# EAGLE design USBIRToy-shield (EAGLE 5.07)
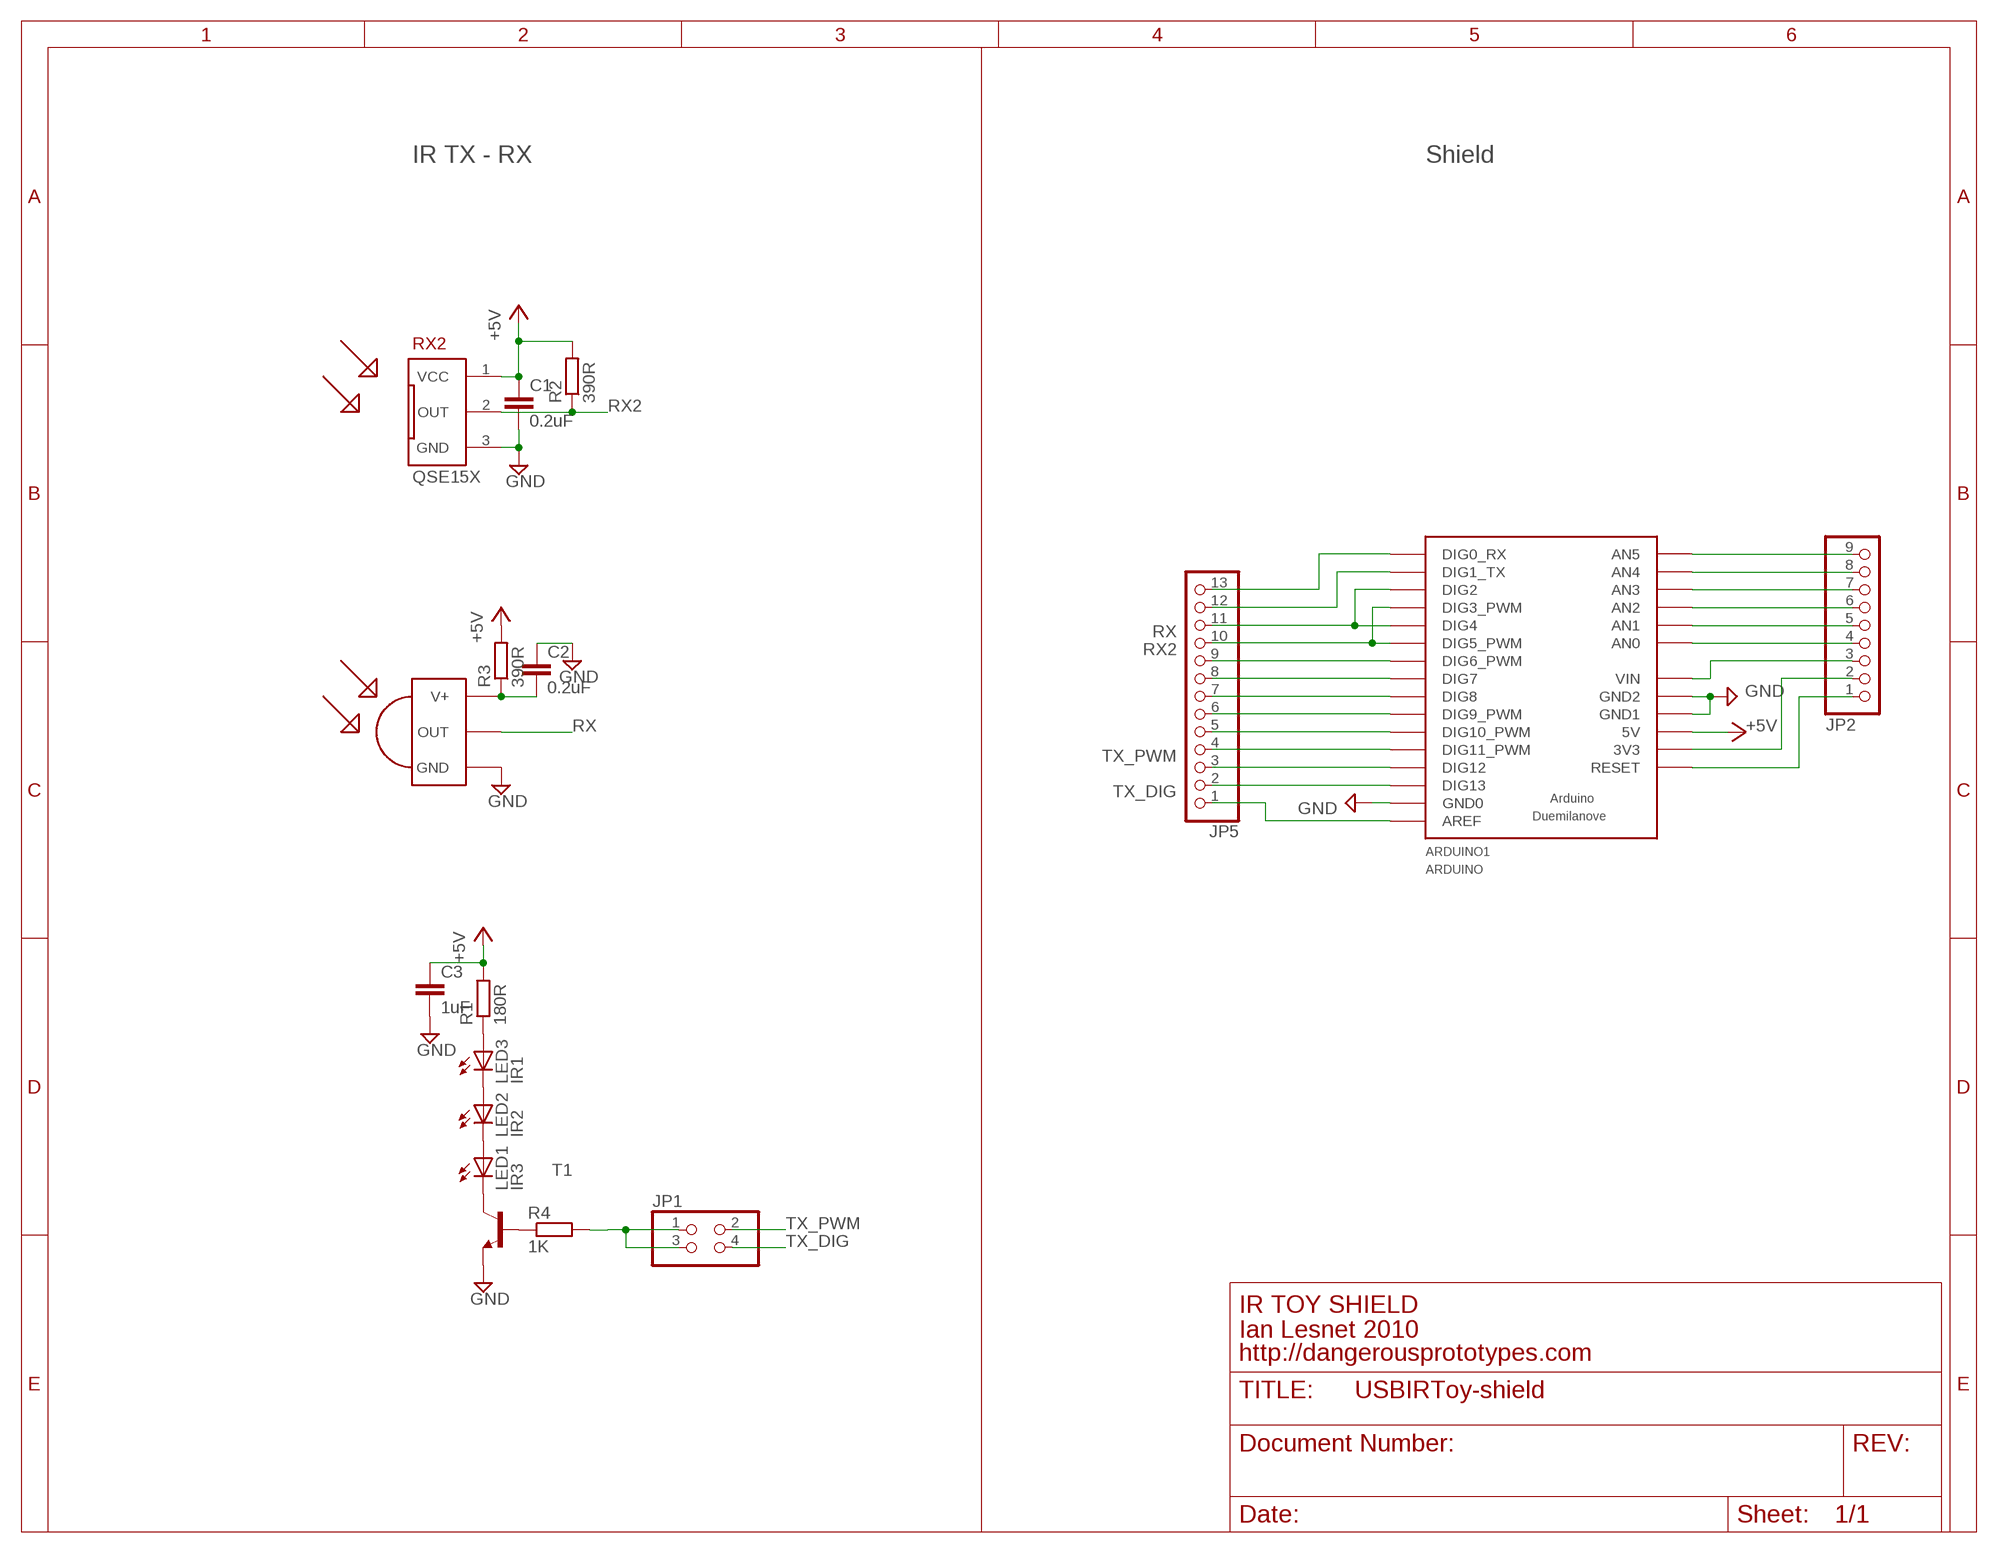
[diagram p0: schematic, sheet 1]

## Parts
ARDUINO1  ARDUINO  [ARDUINO]
C1  0.2uF  C-EUC0603  [C0603]
C2  0.2uF  C-EUC0603  [C0603]
C3  1uF  C-EUC0603  [C0603]
JP1  PINHD-2X02_2.54  [2X02]
JP2  PINHD-1X09_2.54-S  [1X09-S]
JP5  PINHD-1X13_2.54-S  [1X13-S]
LED1  IR3  LED5MM  [LED5MM]
LED2  IR2  LED5MM  [LED5MM]
LED3  IR1  LED5MM  [LED5MM]
R1  180R  R-EU_R0805  [R0805]
R2  390R  R-EU_R0603  [R0603]
R3  390R  R-EU_R0603  [R0603]
R4  1K  R-EU_R0603  [R0603]
RX1  TSOP4838  [TSOP18XX]
RX2  QSE15X  [QSE15X]
T1  NPNSOT23BEC  [SOT23-BEC]

## Nets
+5V: ARDUINO1.5V C1.1 C3.1 R1.2 R2.2 R3.2 RX2.1(VCC)
GND: ARDUINO1.GND0 ARDUINO1.GND1 ARDUINO1.GND2 C1.2 C2.1 C3.2 RX1.GND RX2.3(GND) T1.E
N$1: LED1.K(C) T1.C
N$2: LED1.A LED2.K(C)
N$3: LED2.A LED3.K(C)
N$4: LED3.A R1.1
N$5: R4.1 T1.B
N$7: C2.2 R3.1 RX1.VCC(V+)
N$209: ARDUINO1.D_0(DIG0_RX) JP5.13
N$210: ARDUINO1.D_1(DIG1_TX) JP5.12
N$211: ARDUINO1.D_6(DIG6_PWM) JP5.9
N$212: ARDUINO1.D_7(DIG7) JP5.8
N$213: ARDUINO1.D_8(DIG8) JP5.7
N$214: ARDUINO1.D_9(DIG9_PWM) JP5.6
N$215: ARDUINO1.D_10(DIG10_PWM) JP5.5
N$216: ARDUINO1.D_12(DIG12) JP5.3
N$217: ARDUINO1.AREF JP5.1
N$218: ARDUINO1.A_5(AN5) JP2.9
N$219: ARDUINO1.A_4(AN4) JP2.8
N$220: ARDUINO1.A_3(AN3) JP2.7
N$221: ARDUINO1.A_2(AN2) JP2.6
N$222: ARDUINO1.A_1(AN1) JP2.5
N$223: ARDUINO1.A_0(AN0) JP2.4
N$224: ARDUINO1.VIN JP2.3
N$225: ARDUINO1.3V3 JP2.2
N$226: ARDUINO1.RESET JP2.1
RX: ARDUINO1.D_2(DIG2) ARDUINO1.D_4(DIG4) JP5.11 RX1.OUT
RX2: ARDUINO1.D_3(DIG3_PWM) ARDUINO1.D_5(DIG5_PWM) JP5.10 R2.1 RX2.2(OUT)
TX: JP1.1 JP1.3 R4.2
TX_DIG: ARDUINO1.D_13(DIG13) JP1.4 JP5.2
TX_PWM: ARDUINO1.D_11(DIG11_PWM) JP1.2 JP5.4

## Notes on the sheet
- IR TX - RX | Shield
- IR TOY SHIELD
- Ian Lesnet 2010
- http://dangerousprototypes.com

## Library data of the parts
ARDUINO1 = dp_devices:ARDUINO
C1-C3 = rcl:C-EU: CAPACITOR, European symbol
JP1 = pinhead-2:PINHD-2X02: PIN HEADER
JP2 = pinhead-2:PINHD-1X09: PIN HEADER
JP5 = pinhead-2:PINHD-1X13: PIN HEADER
LED1-LED3 = led:LED: LED OSRAM: - CHIPLED LG R971, LG N971, LY N971, LG Q971, LY Q971, LO R971, LY R971 LH N974, LH R974 LS Q976, LO Q976, LY Q976 LO Q996 - Hyper CHIPLED LW Q18S LB Q993, LB Q99A, LB R99A - SideLED LS A670, LO A670, LY A670, LG A670, LP A670 LB A673, LV A673, LT A673, LW A673 LH A674 LY A675 LS A676, LA A676, LO A676, LY A676, LW A676 LS A679, LY A679, LG A679 - Hyper Micro SIDELED® LS Y876, LA Y876, LO Y876, LY Y876 LT Y87S - SmartLED LW L88C, LW L88S LB L89C, LB L89S, LG L890 LS L89K, LO L89K, LY L89K LS L896, LA L896, LO L896, LY L896 - TOPLED LS T670, LO T670, LY T670, LG T670, LP T670 LSG T670, LSP T670, LSY T670, LOP T670, LYG T670 LG T671, LOG T671, LSG T671 LB T673, LV T673, LT T673, LW T673 LH T674 LS T676, LA T676, LO T676, LY T676, LB T676, LH T676, LSB T676, LW T676 LB T67C, LV T67C, LT T67C, LS T67K, LO T67K, LY T67K, LW E67C LS E67B, LA E67B, LO E67B, LY E67B, LB E67C, LV E67C, LT E67C LW T67C LS T679, LY T679, LG T679 LS T770, LO T770, LY T770, LG T770, LP T770 LB T773, LV T773, LT T773, LW T773 LH T774 LS E675, LA E675, LY E675, LS T675 LS T776, LA T776, LO T776, LY T776, LB T776 LHGB T686 LT T68C, LB T68C - Hyper Mini TOPLED® LB M676 - Mini TOPLED Santana® LG M470 LS M47K, LO M47K, LY M47K Source: http://www.osram.convergy.de LUXEON: - LUMILED® LXK2-PW12-R00, LXK2-PW12-S00, LXK2-PW14-U00, LXK2-PW14-V00 LXK2-PM12-R00, LXK2-PM12-S00, LXK2-PM14-U00 LXK2-PE12-Q00, LXK2-PE12-R00, LXK2-PE12-S00, LXK2-PE14-T00, LXK2-PE14-U00 LXK2-PB12-K00, LXK2-PB12-L00, LXK2-PB12-M00, LXK2-PB14-N00, LXK2-PB14-P00, LXK2-PB14-Q00 LXK2-PR12-L00, LXK2-PR12-M00, LXK2-PR14-Q00, LXK2-PR14-R00 LXK2-PD12-Q00, LXK2-PD12-R00, LXK2-PD12-S00 LXK2-PH12-R00, LXK2-PH12-S00 LXK2-PL12-P00, LXK2-PL12-Q00, LXK2-PL12-R00 Source: www.luxeon.com KINGBRIGHT: KA-3528ASYC Source: www.kingbright.com
R1-R4 = rcl:R-EU_: RESISTOR, European symbol
RX1 = tsop:TSOP4838: IR Receiver and Demodulator
RX2 = dp_devices:QSE15X
T1 = dp_devices:NPN: Most commonly used is SOT23-BEC

## Board
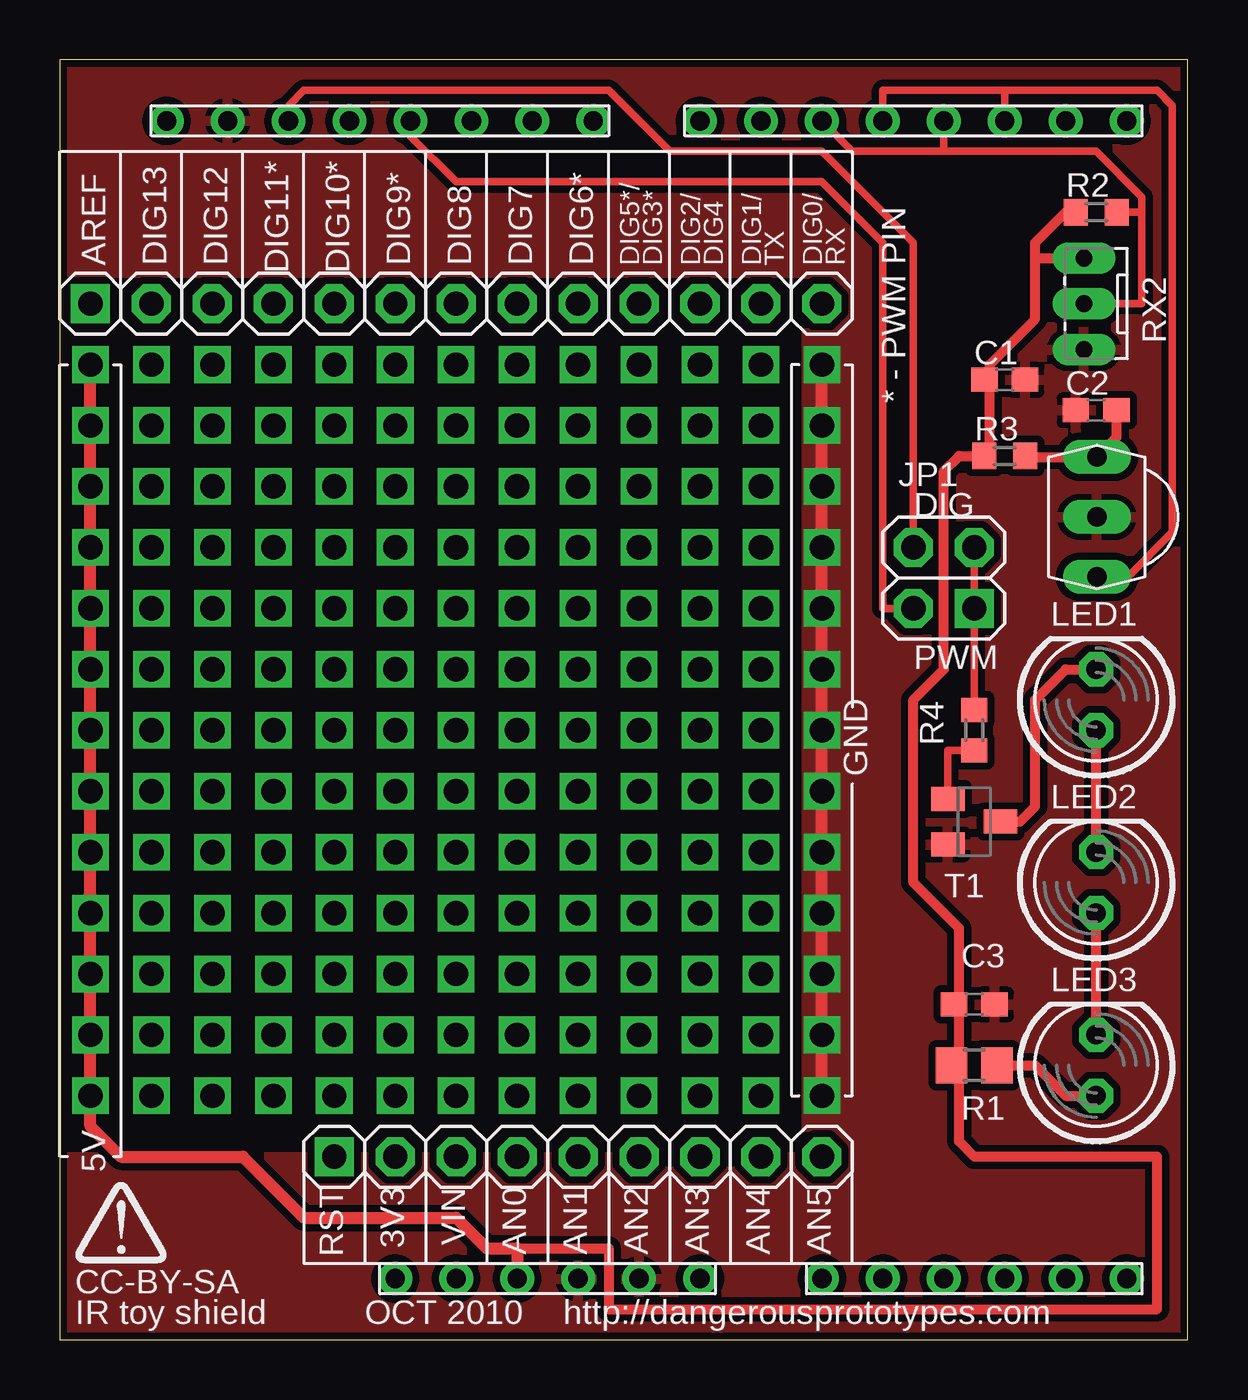
[diagram p1: board, top side]
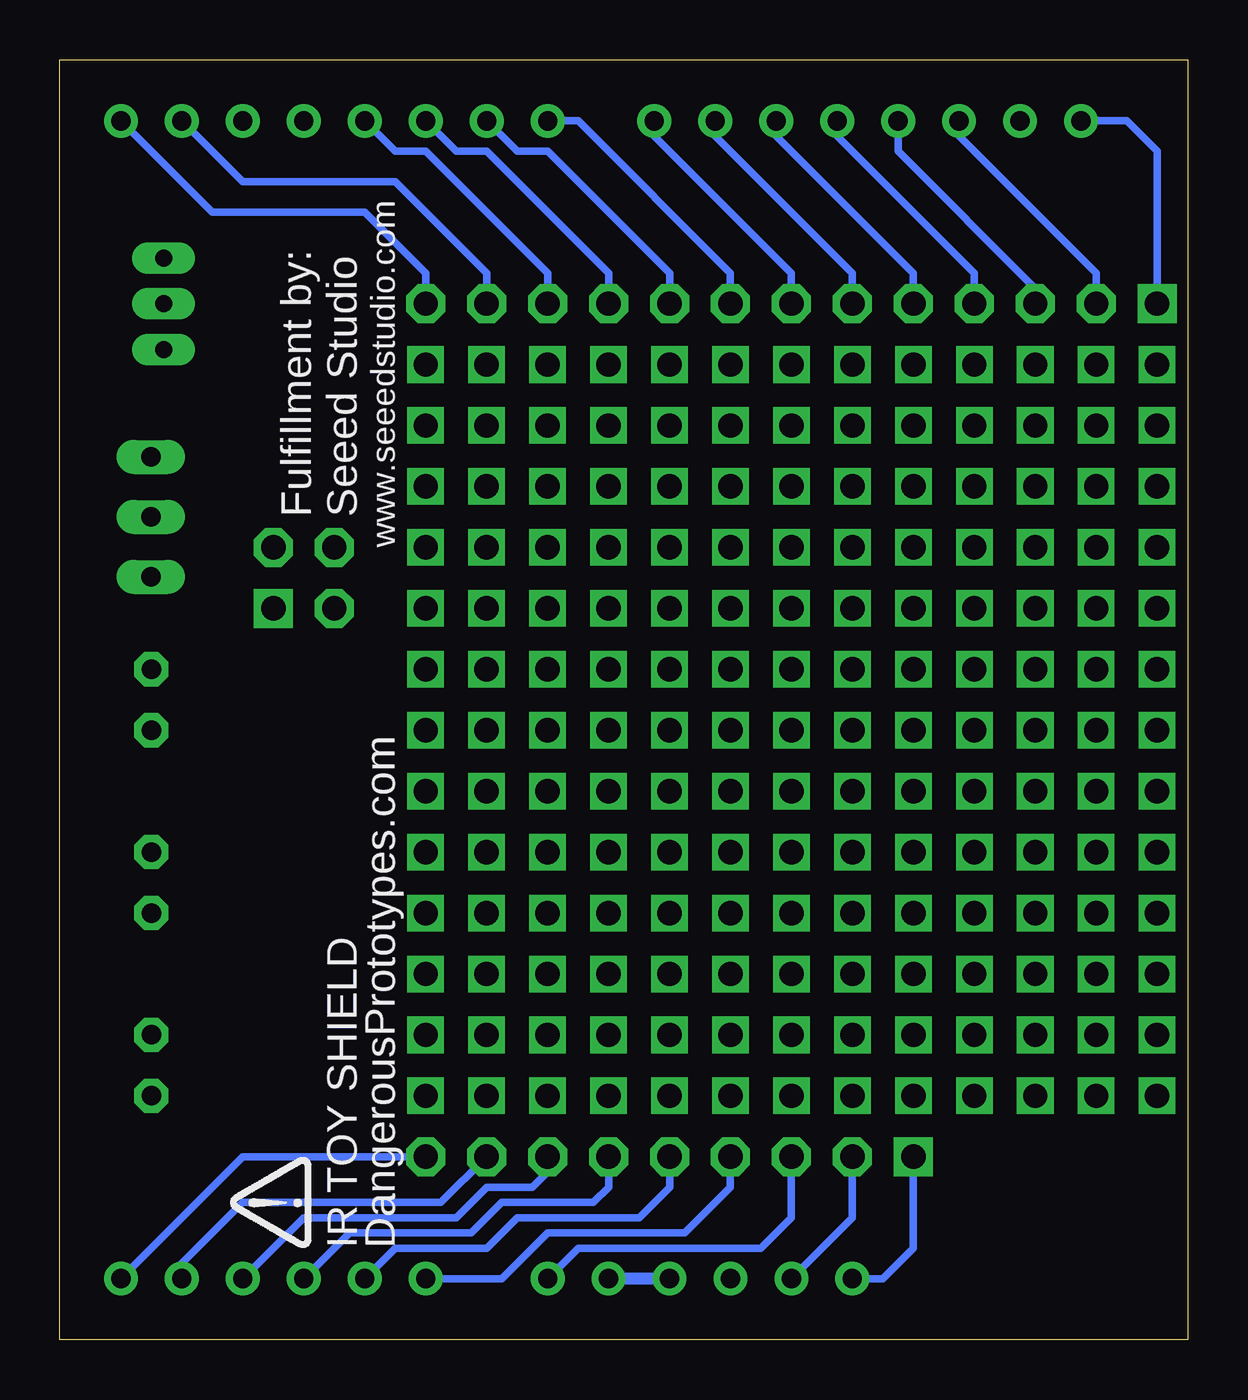
[diagram p2: board, bottom side, seen from below]

Size 46.99 x 53.34 mm. Coordinates in mm from the lower left corner, seen from the top.
Outline: 0,0 46.99,0 46.99,53.34 0,53.34 0,0
Copper layers (1*16): Top 0.035mm / dielectric 1.5mm / Bottom 0.035mm
Design rules "SparkFun": minimum track width 8mil, minimum drill 20mil, track to track 8mil, track to pad 8mil, pad to pad 8mil, via to via 8mil, smd to smd 8mil, copper to edge 10mil, drill to drill 8mil, minimum pad ring 12mil, minimum via ring 10mil, stop-mask expansion 4mil, vias tented up to drill 25mil, thermal gap 10mil

### Footprints (pad centres in the part's own frame; a part is rotated, then mirrored left to right if it is on the bottom)
ARDUINO = drill 0.8 round: 3V3 25.4,-12.7; 5V 25.4,-10.16; A_0 25.4,2.54; A_1 25.4,5.08; A_2 25.4,7.62; A_3 25.4,10.16; A_4 25.4,12.7; A_5 25.4,15.24; AREF -22.86,-24.765; D_0 -22.86,15.24; D_1 -22.86,12.7; D_2 -22.86,10.16; D_3 -22.86,7.62; D_4 -22.86,5.08; D_5 -22.86,2.54; D_6 -22.86,0; D_7 -22.86,-2.54; D_8 -22.86,-6.985; D_9 -22.86,-9.525; D_10 -22.86,-12.065; D_11 -22.86,-14.605; D_12 -22.86,-17.145; D_13 -22.86,-19.685; GND0 -22.86,-22.225; GND1 25.4,-7.62; GND2 25.4,-5.08; RESET 25.4,-15.24; VIN 25.4,-2.54
C0603 = smd 1.1 x 1: 1 -0.85,0; 2 0.85,0
2X02 = drill 1.016 square: 1 -1.27,-1.27 | drill 1.016 octagon: 2 -1.27,1.27; 3 1.27,-1.27; 4 1.27,1.27
1X09-S = drill 1.016 square: 1 -10.16,0 | drill 1.016 octagon: 2 -7.62,0; 3 -5.08,0; 4 -2.54,0; 5 0,0; 6 2.54,0; 7 5.08,0; 8 7.62,0; 9 10.16,0
1X13-S = drill 1.016 square: 1 -15.24,0 | drill 1.016 octagon: 2 -12.7,0; 3 -10.16,0; 4 -7.62,0; 5 -5.08,0; 6 -2.54,0; 7 0,0; 8 2.54,0; 9 5.08,0; 10 7.62,0; 11 10.16,0; 12 12.7,0; 13 15.24,0
LED5MM = drill 0.813 octagon: A -1.27,0; K 1.27,0
R0805 = smd 1.3 x 1.5: 1 -0.95,0; 2 0.95,0
R0603 = smd 1 x 1.1: 1 -0.85,0; 2 0.85,0
TSOP18XX = drill 0.813 long: GND -0.001,-0.027; OUT -2.501,-0.027; VCC 2.499,-0.027
QSE15X = drill 0.7 long: 1 -1.9,-0.51; 2 0,-0.51; 3 1.91,-0.51
SOT23-BEC = smd 1 x 1.4: B -0.95,-1.1; C 0,1.1; E 0.95,-1.1

### Placement (x,y rotation side)
ARDUINO1  29.21,27.94 270 top
C1  39.37,40.01 0 top
C2  43.18,38.73 0 top
C3  38.1,13.97 0 top
JP1  36.83,31.75 90 top
JP2  21.59,7.62 0 top
JP5  16.51,43.18 0 top
LED1  43.18,26.67 90 top
LED2  43.18,19.05 90 top
LED3  43.18,11.43 90 top
R1  38.1,11.43 180 top
R2  43.18,46.99 180 top
R3  39.37,36.83 180 top
R4  38.1,25.4 90 top
RX1  43.18,34.29 90 top
RX2  43.18,43.18 270 top
T1  38.1,21.59 270 top
U$1  [DP-LOGO_TOP]  0.64,3.17 0 top
U$2  [DP-LOGO-BOTTOM]  36.51,7.62 270 top

### Tracks (layer width: path | path; a pad name or v marks a point on that pad's centre or on a via)
+5V  (via drill 1.02)
  Top 0.406: 37.47,14.19 37.47,17.14 35.56,19.05 35.56,26.67 36.83,27.94 36.83,36.2 37.47,36.83 R3.2 | 37.47,11.74 37.47,13.97 | 37.47,11.43 37.47,8.26 38.1,7.62 45.72,7.62 45.72,1.27 22.86,1.27 22.86,3.81 19.05,3.81 | R2.2 41.91,46.99 40.64,45.72 40.64,45.09 | 40.64,45.09 40.64,42.55 38.73,40.64 38.73,40.22 C1.1 38.73,39.79 38.73,37.05 | RX2.1 40.65,45.08 40.64,45.09
  Top 0.508: 37.47,14.19 C3.1 37.47,13.97 | 37.47,11.74 R1.2 36.83,11.11 37.15,11.11 37.47,11.43 | R3.2 38.73,37.05 | v1.27,40.64 v1.27,38.1 v1.27,35.56 v1.27,33.02 v1.27,30.48 v1.27,27.94 v1.27,25.4 v1.27,22.86 v1.27,20.32 v1.27,17.78 v1.27,15.24 v1.27,12.7 v1.27,10.16 1.27,8.89 2.54,7.62 7.62,7.62 10.16,5.08 16.51,5.08 17.78,3.81 19.05,3.81 ARDUINO1.5V
GND  (via drill 1.02)
  Top 0.508: v31.75,40.64 v31.75,38.1 v31.75,35.56 v31.75,33.02 v31.75,30.48 v31.75,27.94 v31.75,25.4 v31.75,22.86 v31.75,20.32 v31.75,17.78 v31.75,15.24 v31.75,12.7 v31.75,10.16
  Bottom 0.508: ARDUINO1.GND1 ARDUINO1.GND2
  pour Top (isolate 0.305): 0,53.34 46.99,53.34 46.99,0 0,0 0,7.62 31.11,7.62 31.11,44.45 0,44.45
N$1
  Top 0.406: LED1.K 41.91,27.94 40.64,26.67 40.64,22.23 40.01,21.59 T1.C
N$2
  Top 0.406: LED2.K LED1.A
N$3
  Top 0.406: LED3.K LED2.A
N$4
  Top 0.406: R1.1 40.64,11.43 41.91,10.16 LED3.A
N$5
  Top 0.305: R4.1 37,24.55 T1.B
N$6  (via drill 1.02)
  other vias: 16.51,38.1
N$7
  Top 0.406: C2.2 44.03,37.61 RX1.VCC 40.26,36.79
  Top 0.508: R3.1 40.26,36.79
N$8  (via drill 1.02)
  other vias: 13.97,38.1
N$9  (via drill 1.02)
  other vias: 11.43,38.1
N$10  (via drill 1.02)
  other vias: 8.89,38.1
N$11  (via drill 1.02)
  other vias: 6.35,38.1
N$12  (via drill 1.02)
  other vias: 3.81,38.1
N$14  (via drill 1.02)
  other vias: 19.05,38.1
N$15  (via drill 1.02)
  other vias: 21.59,38.1
N$16  (via drill 1.02)
  other vias: 24.13,38.1
N$17  (via drill 1.02)
  other vias: 26.67,38.1
N$18  (via drill 1.02)
  other vias: 29.21,38.1
N$20  (via drill 1.02)
  other vias: 16.51,35.56
N$21  (via drill 1.02)
  other vias: 13.97,35.56
N$22  (via drill 1.02)
  other vias: 11.43,35.56
N$23  (via drill 1.02)
  other vias: 8.89,35.56
N$24  (via drill 1.02)
  other vias: 6.35,35.56
N$25  (via drill 1.02)
  other vias: 3.81,35.56
N$27  (via drill 1.02)
  other vias: 19.05,35.56
N$28  (via drill 1.02)
  other vias: 21.59,35.56
N$29  (via drill 1.02)
  other vias: 24.13,35.56
N$30  (via drill 1.02)
  other vias: 26.67,35.56
N$31  (via drill 1.02)
  other vias: 29.21,35.56
N$33  (via drill 1.02)
  other vias: 16.51,33.02
N$34  (via drill 1.02)
  other vias: 13.97,33.02
N$35  (via drill 1.02)
  other vias: 11.43,33.02
N$36  (via drill 1.02)
  other vias: 8.89,33.02
N$37  (via drill 1.02)
  other vias: 6.35,33.02
N$38  (via drill 1.02)
  other vias: 3.81,33.02
N$40  (via drill 1.02)
  other vias: 19.05,33.02
N$41  (via drill 1.02)
  other vias: 21.59,33.02
N$42  (via drill 1.02)
  other vias: 24.13,33.02
N$43  (via drill 1.02)
  other vias: 26.67,33.02
N$44  (via drill 1.02)
  other vias: 29.21,33.02
N$46  (via drill 1.02)
  other vias: 16.51,30.48
N$47  (via drill 1.02)
  other vias: 13.97,30.48
N$48  (via drill 1.02)
  other vias: 11.43,30.48
N$49  (via drill 1.02)
  other vias: 8.89,30.48
N$50  (via drill 1.02)
  other vias: 6.35,30.48
N$51  (via drill 1.02)
  other vias: 3.81,30.48
N$53  (via drill 1.02)
  other vias: 19.05,30.48
N$54  (via drill 1.02)
  other vias: 21.59,30.48
N$55  (via drill 1.02)
  other vias: 24.13,30.48
N$56  (via drill 1.02)
  other vias: 26.67,30.48
N$57  (via drill 1.02)
  other vias: 29.21,30.48
N$59  (via drill 1.02)
  other vias: 16.51,27.94
N$60  (via drill 1.02)
  other vias: 13.97,27.94
N$61  (via drill 1.02)
  other vias: 11.43,27.94
N$62  (via drill 1.02)
  other vias: 8.89,27.94
N$63  (via drill 1.02)
  other vias: 6.35,27.94
N$64  (via drill 1.02)
  other vias: 3.81,27.94
N$66  (via drill 1.02)
  other vias: 19.05,27.94
N$67  (via drill 1.02)
  other vias: 21.59,27.94
N$68  (via drill 1.02)
  other vias: 24.13,27.94
N$69  (via drill 1.02)
  other vias: 26.67,27.94
N$70  (via drill 1.02)
  other vias: 29.21,27.94
N$72  (via drill 1.02)
  other vias: 16.51,25.4
N$73  (via drill 1.02)
  other vias: 13.97,25.4
N$74  (via drill 1.02)
  other vias: 16.51,40.64
N$75  (via drill 1.02)
  other vias: 13.97,40.64
N$76  (via drill 1.02)
  other vias: 11.43,40.64
N$77  (via drill 1.02)
  other vias: 8.89,40.64
N$78  (via drill 1.02)
  other vias: 6.35,40.64
N$79  (via drill 1.02)
  other vias: 3.81,40.64
N$81  (via drill 1.02)
  other vias: 19.05,40.64
N$82  (via drill 1.02)
  other vias: 21.59,40.64
N$83  (via drill 1.02)
  other vias: 24.13,40.64
N$84  (via drill 1.02)
  other vias: 26.67,40.64
N$85  (via drill 1.02)
  other vias: 29.21,40.64
N$86  (via drill 1.02)
  other vias: 11.43,25.4
N$87  (via drill 1.02)
  other vias: 8.89,25.4
N$88  (via drill 1.02)
  other vias: 6.35,25.4
N$89  (via drill 1.02)
  other vias: 3.81,25.4
N$91  (via drill 1.02)
  other vias: 19.05,25.4
N$92  (via drill 1.02)
  other vias: 21.59,25.4
N$93  (via drill 1.02)
  other vias: 24.13,25.4
N$94  (via drill 1.02)
  other vias: 26.67,25.4
N$95  (via drill 1.02)
  other vias: 29.21,25.4
N$98  (via drill 1.02)
  other vias: 16.51,22.86
N$99  (via drill 1.02)
  other vias: 13.97,22.86
N$100  (via drill 1.02)
  other vias: 11.43,22.86
N$101  (via drill 1.02)
  other vias: 8.89,22.86
N$102  (via drill 1.02)
  other vias: 6.35,22.86
N$103  (via drill 1.02)
  other vias: 3.81,22.86
N$105  (via drill 1.02)
  other vias: 19.05,22.86
N$106  (via drill 1.02)
  other vias: 21.59,22.86
N$107  (via drill 1.02)
  other vias: 24.13,22.86
N$108  (via drill 1.02)
  other vias: 26.67,22.86
N$109  (via drill 1.02)
  other vias: 29.21,22.86
N$111  (via drill 1.02)
  other vias: 16.51,20.32
N$112  (via drill 1.02)
  other vias: 13.97,20.32
N$113  (via drill 1.02)
  other vias: 11.43,20.32
N$114  (via drill 1.02)
  other vias: 8.89,20.32
N$115  (via drill 1.02)
  other vias: 6.35,20.32
N$116  (via drill 1.02)
  other vias: 3.81,20.32
N$118  (via drill 1.02)
  other vias: 19.05,20.32
N$119  (via drill 1.02)
  other vias: 21.59,20.32
N$120  (via drill 1.02)
  other vias: 24.13,20.32
N$121  (via drill 1.02)
  other vias: 26.67,20.32
N$122  (via drill 1.02)
  other vias: 29.21,20.32
N$124  (via drill 1.02)
  other vias: 16.51,17.78
N$125  (via drill 1.02)
  other vias: 13.97,17.78
N$126  (via drill 1.02)
  other vias: 11.43,17.78
N$127  (via drill 1.02)
  other vias: 8.89,17.78
N$128  (via drill 1.02)
  other vias: 6.35,17.78
N$129  (via drill 1.02)
  other vias: 3.81,17.78
N$131  (via drill 1.02)
  other vias: 19.05,17.78
N$132  (via drill 1.02)
  other vias: 21.59,17.78
N$133  (via drill 1.02)
  other vias: 24.13,17.78
N$134  (via drill 1.02)
  other vias: 26.67,17.78
N$135  (via drill 1.02)
  other vias: 29.21,17.78
N$137  (via drill 1.02)
  other vias: 16.51,15.24
N$138  (via drill 1.02)
  other vias: 13.97,15.24
N$139  (via drill 1.02)
  other vias: 11.43,15.24
N$140  (via drill 1.02)
  other vias: 8.89,15.24
N$141  (via drill 1.02)
  other vias: 6.35,15.24
N$142  (via drill 1.02)
  other vias: 3.81,15.24
N$144  (via drill 1.02)
  other vias: 19.05,15.24
N$145  (via drill 1.02)
  other vias: 21.59,15.24
N$146  (via drill 1.02)
  other vias: 24.13,15.24
N$147  (via drill 1.02)
  other vias: 26.67,15.24
N$148  (via drill 1.02)
  other vias: 29.21,15.24
N$150  (via drill 1.02)
  other vias: 16.51,12.7
N$151  (via drill 1.02)
  other vias: 13.97,12.7
N$152  (via drill 1.02)
  other vias: 11.43,12.7
N$153  (via drill 1.02)
  other vias: 8.89,12.7
N$154  (via drill 1.02)
  other vias: 6.35,12.7
N$155  (via drill 1.02)
  other vias: 3.81,12.7
N$157  (via drill 1.02)
  other vias: 19.05,12.7
N$158  (via drill 1.02)
  other vias: 21.59,12.7
N$159  (via drill 1.02)
  other vias: 24.13,12.7
N$160  (via drill 1.02)
  other vias: 26.67,12.7
N$161  (via drill 1.02)
  other vias: 29.21,12.7
N$163  (via drill 1.02)
  other vias: 16.51,10.16
N$164  (via drill 1.02)
  other vias: 13.97,10.16
N$165  (via drill 1.02)
  other vias: 11.43,10.16
N$166  (via drill 1.02)
  other vias: 8.89,10.16
N$167  (via drill 1.02)
  other vias: 6.35,10.16
N$168  (via drill 1.02)
  other vias: 3.81,10.16
N$170  (via drill 1.02)
  other vias: 19.05,10.16
N$171  (via drill 1.02)
  other vias: 21.59,10.16
N$172  (via drill 1.02)
  other vias: 24.13,10.16
N$173  (via drill 1.02)
  other vias: 26.67,10.16
N$174  (via drill 1.02)
  other vias: 29.21,10.16
N$209
  Bottom 0.305: ARDUINO1.D_0 40.64,46.99 34.29,46.99 31.75,44.45 JP5.13
N$210
  Bottom 0.305: ARDUINO1.D_1 39.37,48.26 33.02,48.26 29.21,44.45 JP5.12
N$211
  Bottom 0.305: ARDUINO1.D_6 27.94,49.53 26.67,49.53 21.59,44.45 JP5.9
N$212
  Bottom 0.305: ARDUINO1.D_7 25.4,50.8 19.05,44.45 JP5.8
N$213
  Bottom 0.305: ARDUINO1.D_8 22.23,50.16 16.51,44.45 JP5.7
N$214
  Bottom 0.305: ARDUINO1.D_9 19.68,50.16 13.97,44.45 JP5.6
N$215
  Bottom 0.305: ARDUINO1.D_10 17.14,50.16 11.43,44.45 JP5.5
N$216
  Bottom 0.305: ARDUINO1.D_12 12.06,49.53 6.35,43.81 JP5.3
N$217
  Bottom 0.305: ARDUINO1.AREF 2.54,50.8 1.27,49.53 JP5.1
N$218
  Bottom 0.305: JP2.9 39.37,7.62 ARDUINO1.A_5
N$219
  Bottom 0.305: JP2.8 31.11,5.71 39.37,5.71 41.91,3.17 ARDUINO1.A_4
N$220
  Bottom 0.305: JP2.7 26.67,6.99 27.3,6.35 29.21,6.35 30.48,5.08 36.83,5.08 ARDUINO1.A_3
N$221
  Bottom 0.305: JP2.6 24.13,6.35 24.77,5.71 28.57,5.71 29.84,4.45 34.92,4.45 ARDUINO1.A_2
N$222
  Bottom 0.305: JP2.5 21.59,6.35 22.86,5.08 27.94,5.08 29.21,3.81 33.02,3.81 ARDUINO1.A_1
N$223
  Bottom 0.305: JP2.4 19.05,6.35 20.95,4.45 26.67,4.45 28.57,2.54 ARDUINO1.A_0
N$224
  Bottom 0.305: ARDUINO1.VIN 25.4,3.81 17.78,3.81 16.51,5.08 JP2.3
N$225
  Bottom 0.305: JP2.2 13.97,5.08 ARDUINO1.3V3
N$226
  Bottom 0.305: JP2.1 11.43,3.81 12.7,2.54 ARDUINO1.RESET
RX
  Top 0.305: RX1.OUT 44.49,31.79 46.35,33.66 46.35,51.44 45.72,52.07 39.37,52.07 | ARDUINO1.D_4 34.29,52.07 39.37,52.07 | 39.37,52.07 ARDUINO1.D_2
  Bottom 0.305: ARDUINO1.D_4 33.02,49.53 31.75,49.53 26.67,44.45 JP5.11
RX2
  Top 0.305: 36.83,49.53 ARDUINO1.D_3 | ARDUINO1.D_5 33.02,49.53 36.83,49.53 | 36.83,49.53 43.18,49.53 45.09,47.62 45.09,46.99 | 45.09,46.99 45.09,43.18 RX2.2 | 45.09,46.99 R2.1
  Bottom 0.305: ARDUINO1.D_5 30.48,49.53 29.21,49.53 24.13,44.45 JP5.10
TX
  Top 0.305: R4.2 JP1.1 JP1.3
TX_DIG
  Top 0.305: ARDUINO1.D_13 9.53,51.44 10.16,52.07 22.86,52.07 25.4,49.53 31.75,49.53 35.56,45.72 JP1.4
  Bottom 0.305: ARDUINO1.D_13 9.53,50.16 3.81,44.45 JP5.2
TX_PWM
  Top 0.305: JP1.2 34.29,30.48 34.29,45.72 31.75,48.26 16.51,48.26 14.61,50.16 ARDUINO1.D_11
  Bottom 0.305: ARDUINO1.D_11 14.61,50.16 8.89,44.45 JP5.4

### Text on the board
tNames: AREF | DIG13 | DIG12 | DIG9* | DIG8 | DIG7 | DIG6* | DIG5*/ | DIG3* | DIG2/ | DIG4 | DIG1/ | TX | DIG0/ | RX | DIG11* | DIG10* | * - PWM PIN | DIG | PWM | GND | 5V | RST | 3V3 | VIN | AN0 | AN1 | AN2 | AN3 | AN4 | AN5 | CC-BY-SA | IR toy shield | OCT 2010 | http://dangerousprototypes.com
bNames: Seeed Studio | Fulfillment by: | www.seeedstudio.com | DangerousPrototypes.com | IR TOY SHIELD
Reference: IR TOY SHIELD | CC-BY-SA | Ian Lesnet 2010 | http://dangerousprototypes.com